# EAGLE schematic TommyPROM-8755A Nano (EAGLE 8.0.0)
Tom's EPROM programmer hosted on Arduino Nano.
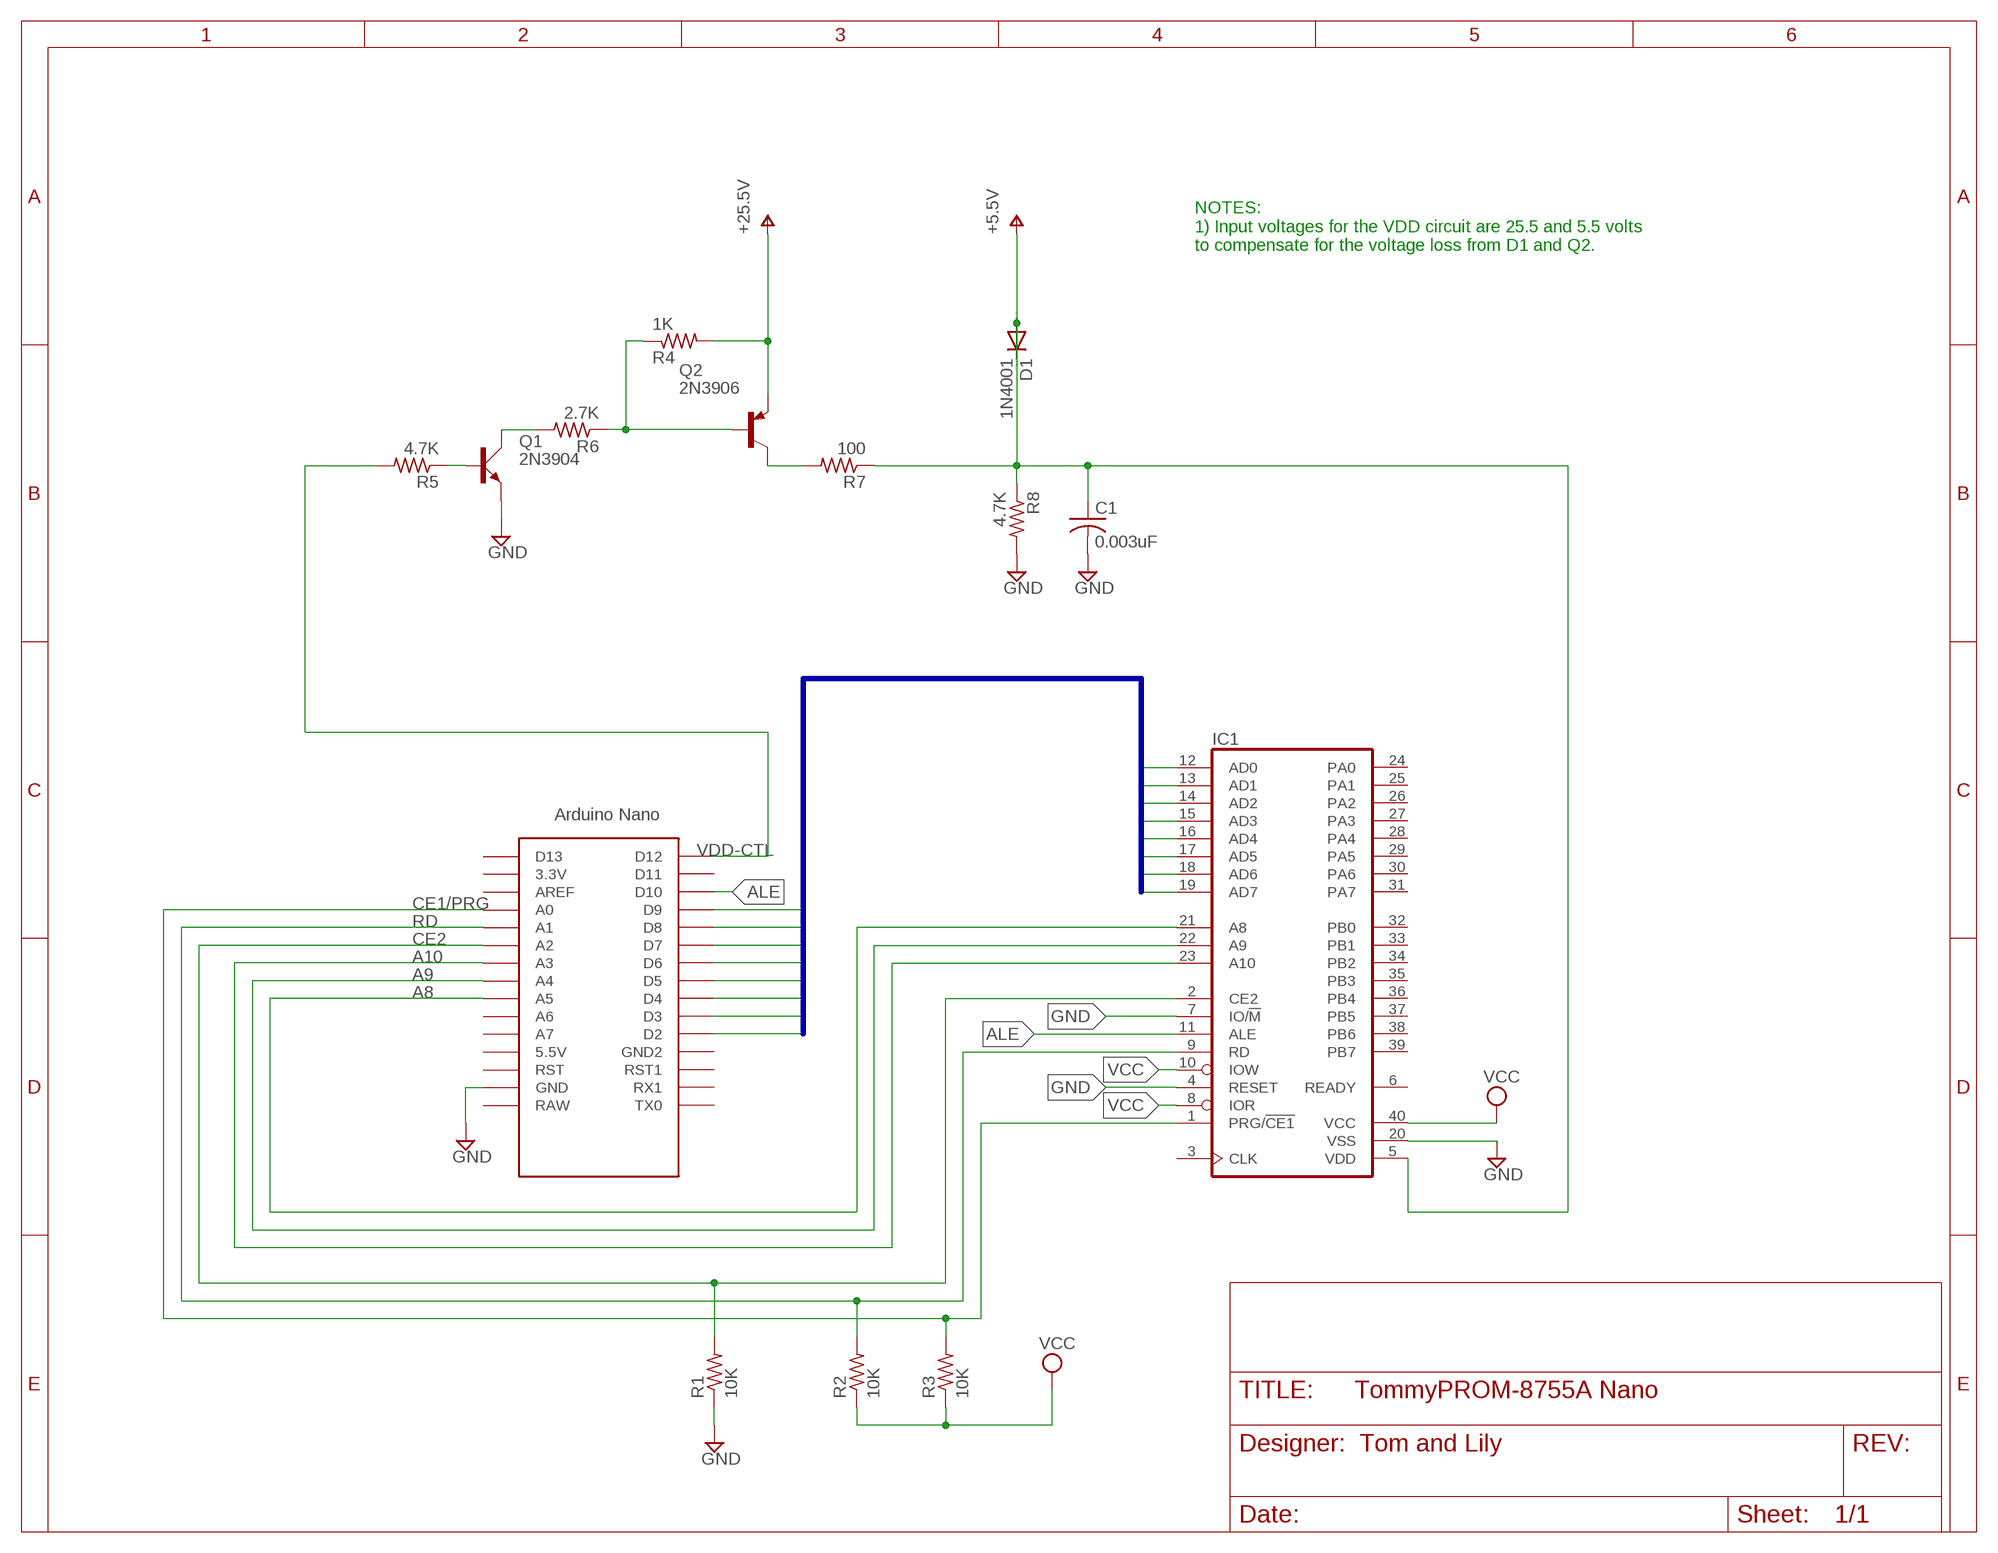
[diagram p0: schematic, sheet 1]

## Parts
C1  0.003uF  C-US025-024X044  [C025-024X044]
D1  1N4001  1N4004  [DO41-10]
IC1  8755  [DIL40]
Q1  2N3904  [TO92D]
Q2  2N3906  [TO92]
R1  10K  R-US_0204/5  [0204/5]
R2  10K  R-US_0204/5  [0204/5]
R3  10K  R-US_0204/5  [0204/5]
R4  1K  R-US_0204/5  [0204/5]
R5  4.7K  R-US_0204/5  [0204/5]
R6  2.7K  R-US_0204/5  [0204/5]
R7  100  R-US_0204/5  [0204/5]
R8  4.7K  R-US_0204/5  [0204/5]
U$2  NANO  [NANO]

## Nets
A8: IC1.21(A8) U$2.A5
A9: IC1.22(A9) U$2.A4
A10: IC1.23(A10) U$2.A3
ALE: IC1.11(ALE) U$2.D10
CE1/PRG: IC1.1(PRG/!CE1) R3.2 U$2.A0
CE2: IC1.2(CE2) R1.2 U$2.A2
D0: IC1.12(AD0) U$2.D2
D1: IC1.13(AD1) U$2.D3
D2: IC1.14(AD2) U$2.D4
D3: IC1.15(AD3) U$2.D5
D4: IC1.16(AD4) U$2.D6
D5: IC1.17(AD5) U$2.D7
D6: IC1.18(AD6) U$2.D8
D7: IC1.19(AD7) U$2.D9
GND: C1.2 IC1.4(RESET) IC1.7(IO/!M) IC1.20(VSS) Q1.E R1.1 R8.2 U$2.GND
N$1: Q2.1(C) R7.2
N$2: Q1.B R5.1
N$3: Q2.2(B) R4.1 R6.1
N$8: Q1.C R6.2
RD: IC1.9(RD) R2.2 U$2.A1
V+: C1.1 D1.A D1.C IC1.5(VDD) Q2.3(E) R4.2 R7.1 R8.1 ; supply symbol labelled +25.5V, +5.5V
VCC: IC1.8(IOR) IC1.10(IOW) IC1.40(VCC) R2.1 R3.1
VDD-CTL: R5.2 U$2.D12
Unconnected: IC1.3(CLK) IC1.6(READY) IC1.24(PA0) IC1.25(PA1) IC1.26(PA2) IC1.27(PA3) IC1.28(PA4) IC1.29(PA5) IC1.30(PA6) IC1.31(PA7) IC1.32(PB0) IC1.33(PB1) IC1.34(PB2) IC1.35(PB3) IC1.36(PB4) IC1.37(PB5) IC1.38(PB6) IC1.39(PB7) U$2.3.3V U$2.5V(5.5V) U$2.A6 U$2.A7 U$2.AREF U$2.D11 U$2.D13 U$2.GND1(GND2) U$2.ICSP1 U$2.ICSP2 U$2.ICSP3 U$2.ICSP4 U$2.ICSP5 U$2.ICSP6 U$2.RAW U$2.RST U$2.RST1 U$2.RX1 U$2.TX0

## Buses
D[0..7]

## Notes on the sheet
- NOTES:
  1) Input voltages for the VDD circuit are 25.5 and 5.5 volts
  to compensate for the voltage loss from D1 and Q2.

## Library data of the parts
C1 = rcl:C-US: CAPACITOR, American symbol
D1 = diode:1N4004: DIODE general purpose rectifier, 1 A
IC1 = micro-intel:8755: MICROCOMPUTER/PERIPHERAL DEVICE; OC_FARNELL: unknown; OC_NEWARK: unknown
Q1 = transistor-small-signal:2N3904: NPN TRANSISTOR
Q2 = transistor-pnp:2N3906: PNP Transistor
R1-R8 = resistor:R-US_: RESISTOR, American symbol
U$2 = Arduino-clone:NANO: Arduino Nano